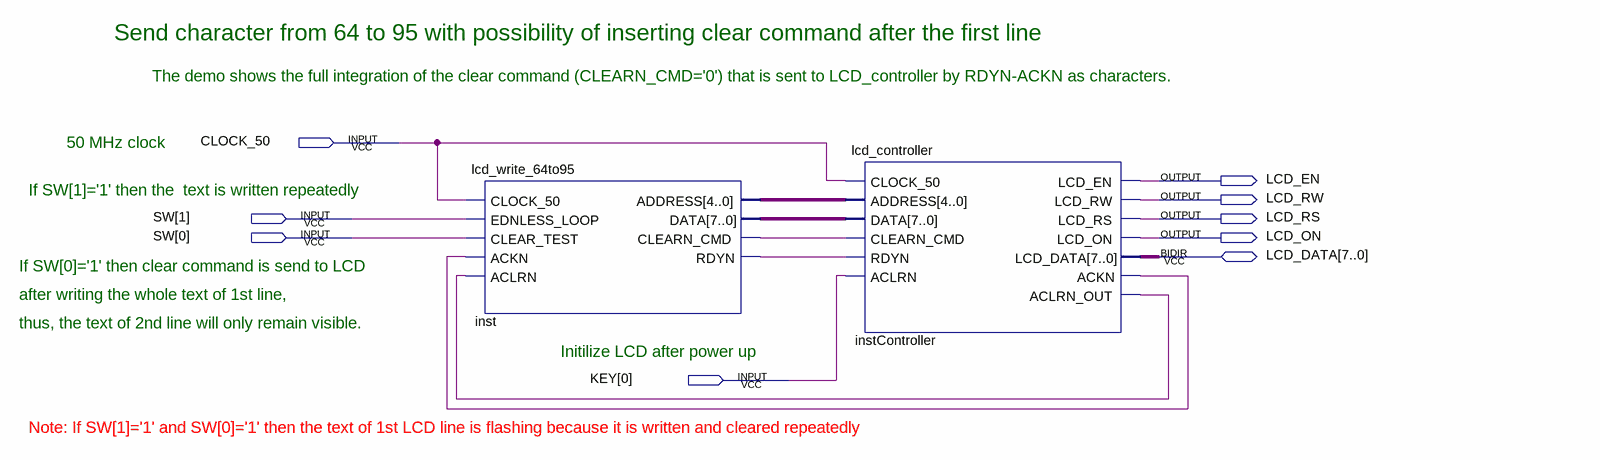
[diagram p0: schematic sheet]
// Quartus schematic lcd_demo_clear_command.bdf as structural Verilog: 2 symbols, 9 pins
module lcd_demo_clear_command (
  input  CLOCK_50,
  input  [1:0] SW,
  input  [0:0] KEY,
  inout  [7:0] LCD_DATA,
  output LCD_EN,
  output LCD_RW,
  output LCD_RS,
  output LCD_ON
);

  wire inst_clearn_cmd, inst_rdyn, instController_ackn, instController_aclrn_out;
  wire [4:0] inst_address;
  wire [7:0] inst_data;

  lcd_write_64to95 inst (
    .CLOCK_50(CLOCK_50), .EDNLESS_LOOP(SW[1]), .CLEAR_TEST(SW[0]), .ACKN(instController_ackn),
    .ACLRN(instController_aclrn_out), .ADDRESS(inst_address), .DATA(inst_data), .CLEARN_CMD(inst_clearn_cmd),
    .RDYN(inst_rdyn));
  lcd_controller instController (
    .CLOCK_50(CLOCK_50), .ADDRESS(inst_address), .DATA(inst_data), .CLEARN_CMD(inst_clearn_cmd),
    .RDYN(inst_rdyn), .ACLRN(KEY[0]), .LCD_EN(LCD_EN), .LCD_RW(LCD_RW), .LCD_RS(LCD_RS), .LCD_ON(LCD_ON),
    .ACKN(instController_ackn), .ACLRN_OUT(instController_aclrn_out), .LCD_DATA(LCD_DATA));

  // Notes on the sheet:
  //   Send character from 64 to 95 with possibility of inserting clear command after the first line
  //   The demo shows the full integration of the clear command (CLEARN_CMD='0') that is sent to LCD_controller by RDYN-ACKN as characters.
  //   50 MHz clock
  //   If SW[1]='1' then the  text is written repeatedly 
  //   If SW[0]='1' then clear command is send to LCD
  //   after writing the whole text of 1st line, 
  //   thus, the text of 2nd line will only remain visible.
  //   Initilize LCD after power up
  //   Note: If SW[1]='1' and SW[0]='1' then the text of 1st LCD line is flashing because it is written and cleared repeatedly  
endmodule
